# EAGLE design Track-Cam (EAGLE 9.2.2)
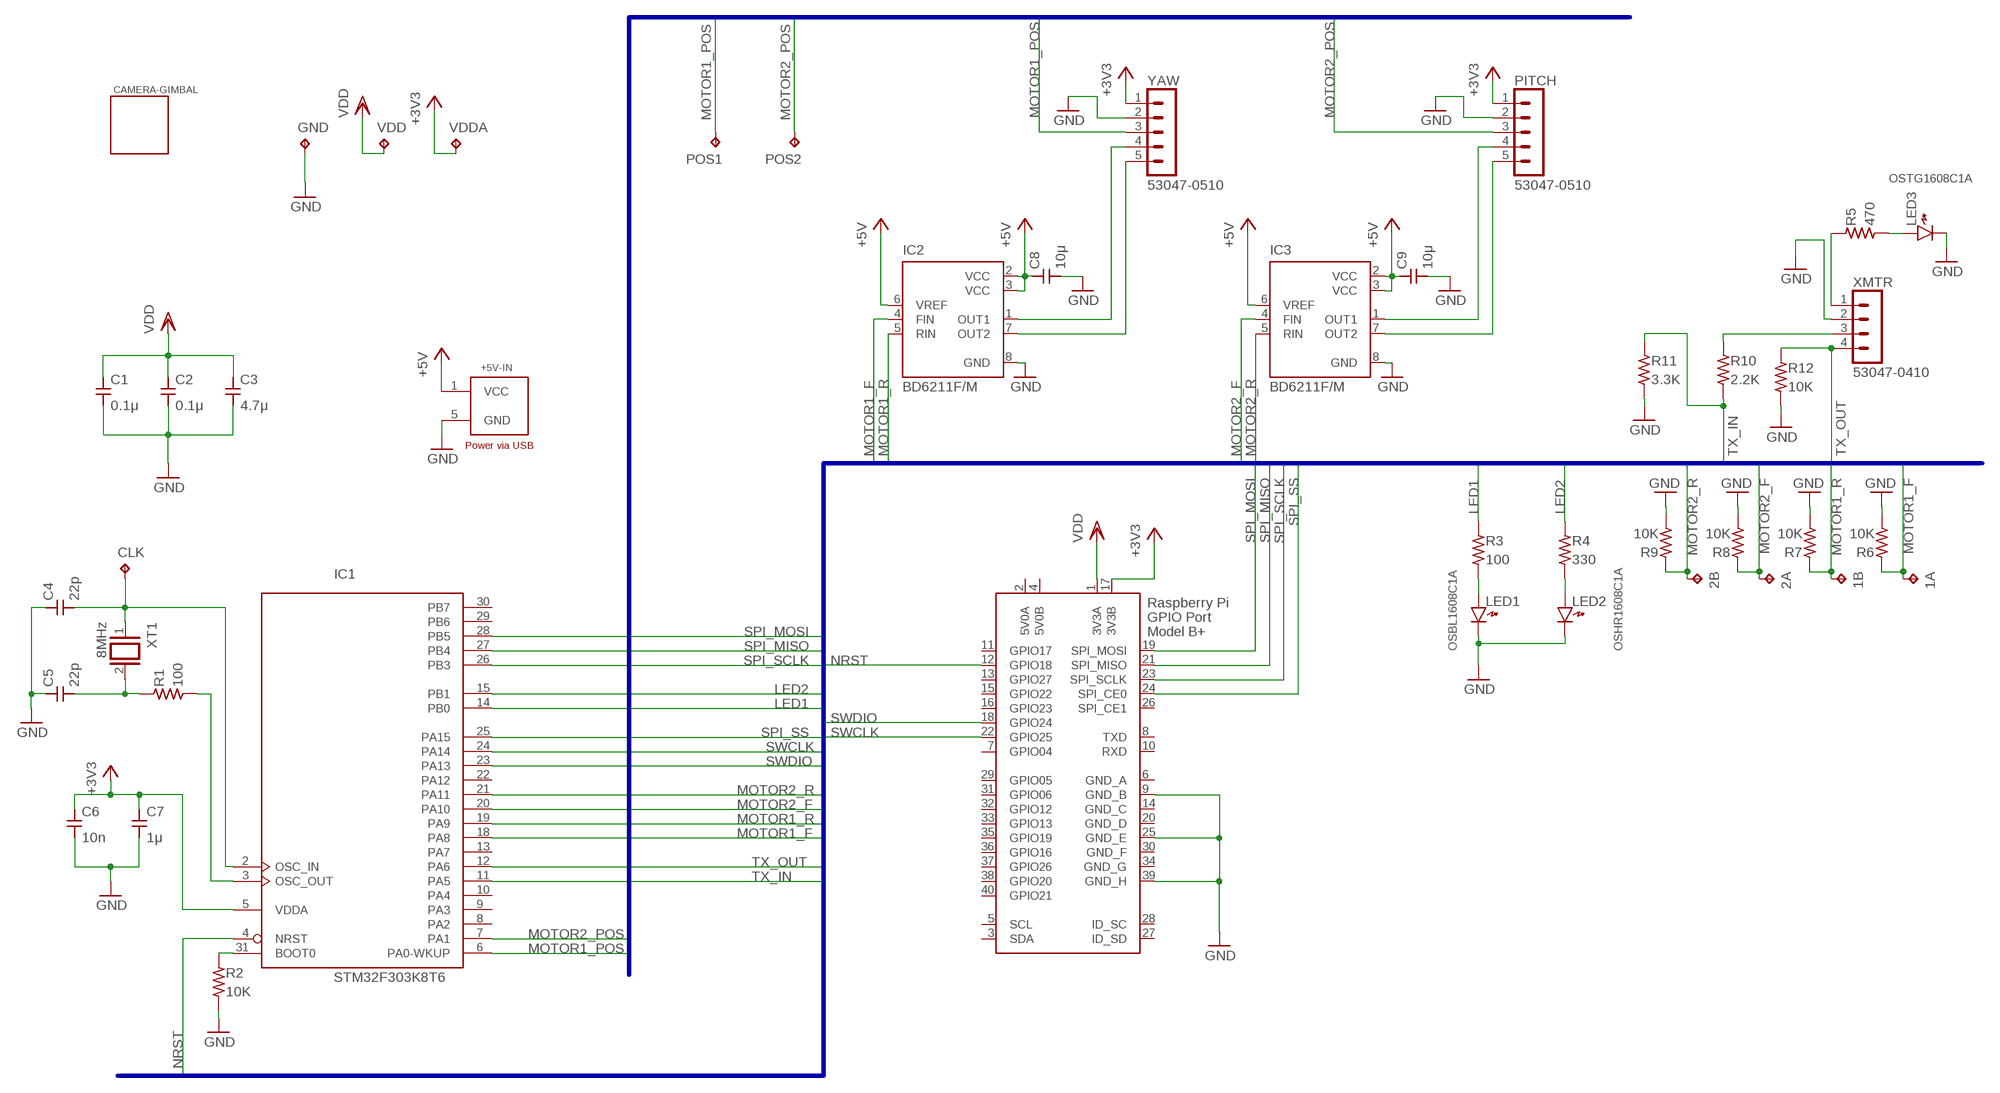
[diagram p0: schematic, sheet 1]

## Parts
1A  TPB1,27  [B1,27]
1B  TPB1,27  [B1,27]
2A  TPB1,27  [B1,27]
2B  TPB1,27  [B1,27]
+5V-IN  MRUSB-2B-D14NI-S306/M  [MICRO-USB-POWER/M]
C1  0.1μ  CAPACITOR2012  [SMD2012]
C2  0.1μ  CAPACITOR2012  [SMD2012]
C3  4.7μ  CAPACITOR2012  [SMD2012]
C4  22p  CAPACITOR1608  [SMD1608]
C5  22p  CAPACITOR1608  [SMD1608]
C6  10n  CAPACITOR2012  [SMD2012]
C7  1μ  CAPACITOR2012  [SMD2012]
C8  10μ  CAPACITOR2012  [SMD2012]
C9  10μ  CAPACITOR2012  [SMD2012]
CAMERA-GIMBAL  SG-90-CAMERA-MOUNT/NR  [SG90-CAMERA-MOUNT-NR]
CLK  TPB1,27  [B1,27]
GND  TPB1,27  [B1,27]
IC1  STM32F303K8T6  STM32F042KT/M  [LQFP32-M]
IC2  BD6211F/M  [SOP8/M]
IC3  BD6211F/M  [SOP8/M]
LED1  LED1608  [LED1608]
LED2  LED1608  [LED1608]
LED3  LED1608  [LED1608]
P1  RASPI_BOARD_B+#_HC  [RASPI_BOARD_B+HAT_CF]
PITCH  53047-0510  [53047-0510]
POS1  TPB1,27  [B1,27]
POS2  TPB1,27  [B1,27]
R1  100  RESISTOR-US2012  [SMD2012]
R2  10K  RESISTOR-US2012  [SMD2012]
R3  100  RESISTOR-US2012  [SMD2012]
R4  330  RESISTOR-US2012  [SMD2012]
R5  470  RESISTOR-US2012  [SMD2012]
R6  10K  RESISTOR-US2012  [SMD2012]
R7  10K  RESISTOR-US2012  [SMD2012]
R8  10K  RESISTOR-US2012  [SMD2012]
R9  10K  RESISTOR-US2012  [SMD2012]
R10  2.2K  RESISTOR-US2012  [SMD2012]
R11  3.3K  RESISTOR-US2012  [SMD2012]
R12  10K  RESISTOR-US2012  [SMD2012]
VDD  TPB1,27  [B1,27]
VDDA  TPB1,27  [B1,27]
XMTR  53047-0410  [53047-0410]
XT1  8MHz  XTAL/S  [QS]
YAW  53047-0510  [53047-0510]

## Nets
+3V3 [power]: C6.1 C7.1 IC1.5(VDDA) P1.17(3V3B) PITCH.1 VDDA.TP YAW.1
+5V [power]: +5V-IN.1(VCC) C8.1 C9.1 IC2.2(VCC) IC2.3(VCC) IC2.6(VREF) IC3.2(VCC) IC3.3(VCC) IC3.6(VREF)
BOOT0: IC1.31(BOOT0) R2.1
GND [gnd]: +5V-IN.5(GND) C1.2 C2.2 C3.2 C4.1 C5.1 C6.2 C7.2 C8.2 C9.2 GND.TP IC2.8(GND) IC3.8(GND) LED1.K LED2.K LED3.K P1.9(GND_B) P1.25(GND_E) P1.39(GND_H) PITCH.2 R2.2 R6.2 R7.2 R8.2 R9.2 R11.2 R12.2 XMTR.2 YAW.2
LED1: IC1.14(PB0) R3.1
LED2: IC1.15(PB1) R4.1
MOTOR1+: IC2.1(OUT1) YAW.4
MOTOR1-: IC2.7(OUT2) YAW.5
MOTOR1_F: 1A.TP IC1.18(PA8) IC2.4(FIN) R6.1
MOTOR1_POS: IC1.6(PA0-WKUP) POS1.TP YAW.3
MOTOR1_R: 1B.TP IC1.19(PA9) IC2.5(RIN) R7.1
MOTOR2+: IC3.1(OUT1) PITCH.4
MOTOR2-: IC3.7(OUT2) PITCH.5
MOTOR2_F: 2A.TP IC1.20(PA10) IC3.4(FIN) R8.1
MOTOR2_POS: IC1.7(PA1) PITCH.3 POS2.TP
MOTOR2_R: 2B.TP IC1.21(PA11) IC3.5(RIN) R9.1
N$1: C5.2 R1.1 XT1.2
N$8: LED1.A R3.2
N$9: LED2.A R4.2
N$10: R5.1 XMTR.1
N$11: LED3.A R5.2
NRST: IC1.4(NRST) P1.12(GPIO18)
OSC_IN: C4.2 CLK.TP IC1.2(OSC_IN) XT1.1
OSC_OUT: IC1.3(OSC_OUT) R1.2
SPI_MISO: IC1.27(PB4) P1.21(SPI_MISO)
SPI_MOSI: IC1.28(PB5) P1.19(SPI_MOSI)
SPI_SCLK: IC1.26(PB3) P1.23(SPI_SCLK)
SPI_SS: IC1.25(PA15) P1.24(SPI_CE0)
SWCLK: IC1.24(PA14) P1.22(GPIO25)
SWDIO: IC1.23(PA13) P1.18(GPIO24)
TX_IN: IC1.11(PA5) R10.2 R11.1
TX_IN_5V: R10.1 XMTR.3
TX_OUT: IC1.12(PA6) R12.1 XMTR.4
VDD [power]: C1.1 C2.1 C3.1 P1.1(3V3A) VDD.TP
Unconnected: IC1.8(PA2) IC1.9(PA3) IC1.10(PA4) IC1.13(PA7) IC1.22(PA12) IC1.29(PB6) IC1.30(PB7) P1.3(SDA) P1.5(SCL) P1.7(GPIO04) P1.8(TXD) P1.10(RXD) P1.11(GPIO17) P1.13(GPIO27) P1.15(GPIO22) P1.16(GPIO23) P1.26(SPI_CE1) P1.27(ID_SD) P1.28(ID_SC) P1.29(GPIO05) P1.31(GPIO06) P1.32(GPIO12) P1.33(GPIO13) P1.35(GPIO19) P1.36(GPIO16) P1.37(GPIO26) P1.38(GPIO20) P1.40(GPIO21)

## Buses
DIG[0..12]
ANA[0..1]

## Notes on the sheet
- OSTG1608C1A
- OSBL1608C1A | OSHR1608C1A

## Power pins joined to a net without a drawn wire
5V0A: P1.2(5V0A)
5V0B: P1.4(5V0B)
GND: IC1.16(GND) IC1.32(GND)
GND_A: P1.6(GND_A)
GND_C: P1.14(GND_C)
GND_D: P1.20(GND_D)
GND_F: P1.30(GND_F)
GND_G: P1.34(GND_G)
VDD: IC1.1(VDD) IC1.17(VDD)

## Library data of the parts
1A 1B 2A 2B CLK GND POS1 POS2 VDD VDDA = testpad:TP: Test pad
+5V-IN = connector:MRUSB-2B-D14NI-S306: Useconn Electronics Ltd. Micro USB, B type Female Solder type
C1-C9 = gen-discrete2:CAPACITOR: Generic Capacitor
CAMERA-GIMBAL = mech:SG-90-CAMERA-MOUNT
IC1 = stm32:STM32F042K*T: ARM 32-bit Cortex™-M0 CPU 48 MHz maximum frequency 32 Kbytes of Flash memory 6 kbytes of SRAM 26 GPIOs 2.4 to 3.6 V application supply
IC2 IC3 = rohm-modified:BD621*F: H-bridge driver for brush motors Source: http://www.rohm.com/products/databook/motor/pdf/bd623x_series-e.pdf
LED1-LED3 = gen-discrete:LED: Generic LEDs
P1 = raspi:RASPI_BOARD_B+#: Raspberry Pi GPIO connector with markings for the outer dimensions of the Raspberry Pi board model B+ with different sets of drill holes or mounting pads All pins connected
PITCH YAW = connector:53047-0510: HEADER
R1-R12 = gen-discrete:RESISTOR-US: Generic Registor
XMTR = connector:53047-0410: HEADER
XT1 = gen-discrete:XTAL/S: CRYSTAL

## Net classes
1 gnd: width 0.61 mm, drill 0.203 mm
2 power: width 0.61 mm, drill 0.203 mm

## Board
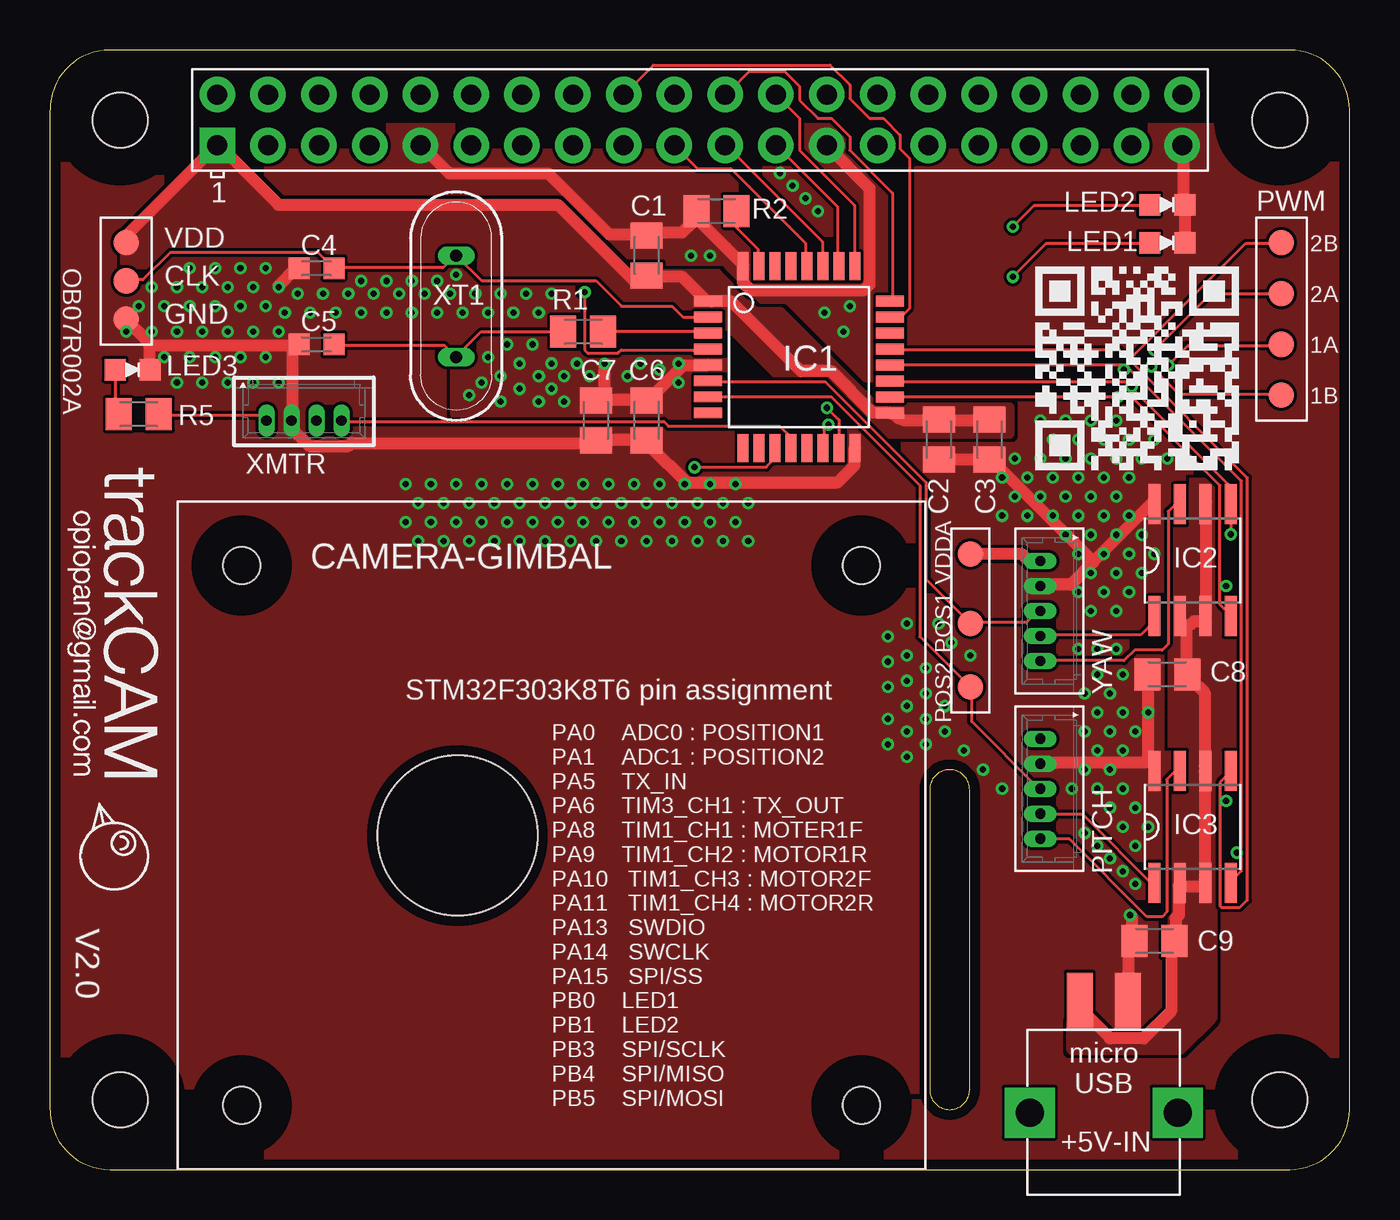
[diagram p1: board, top side]
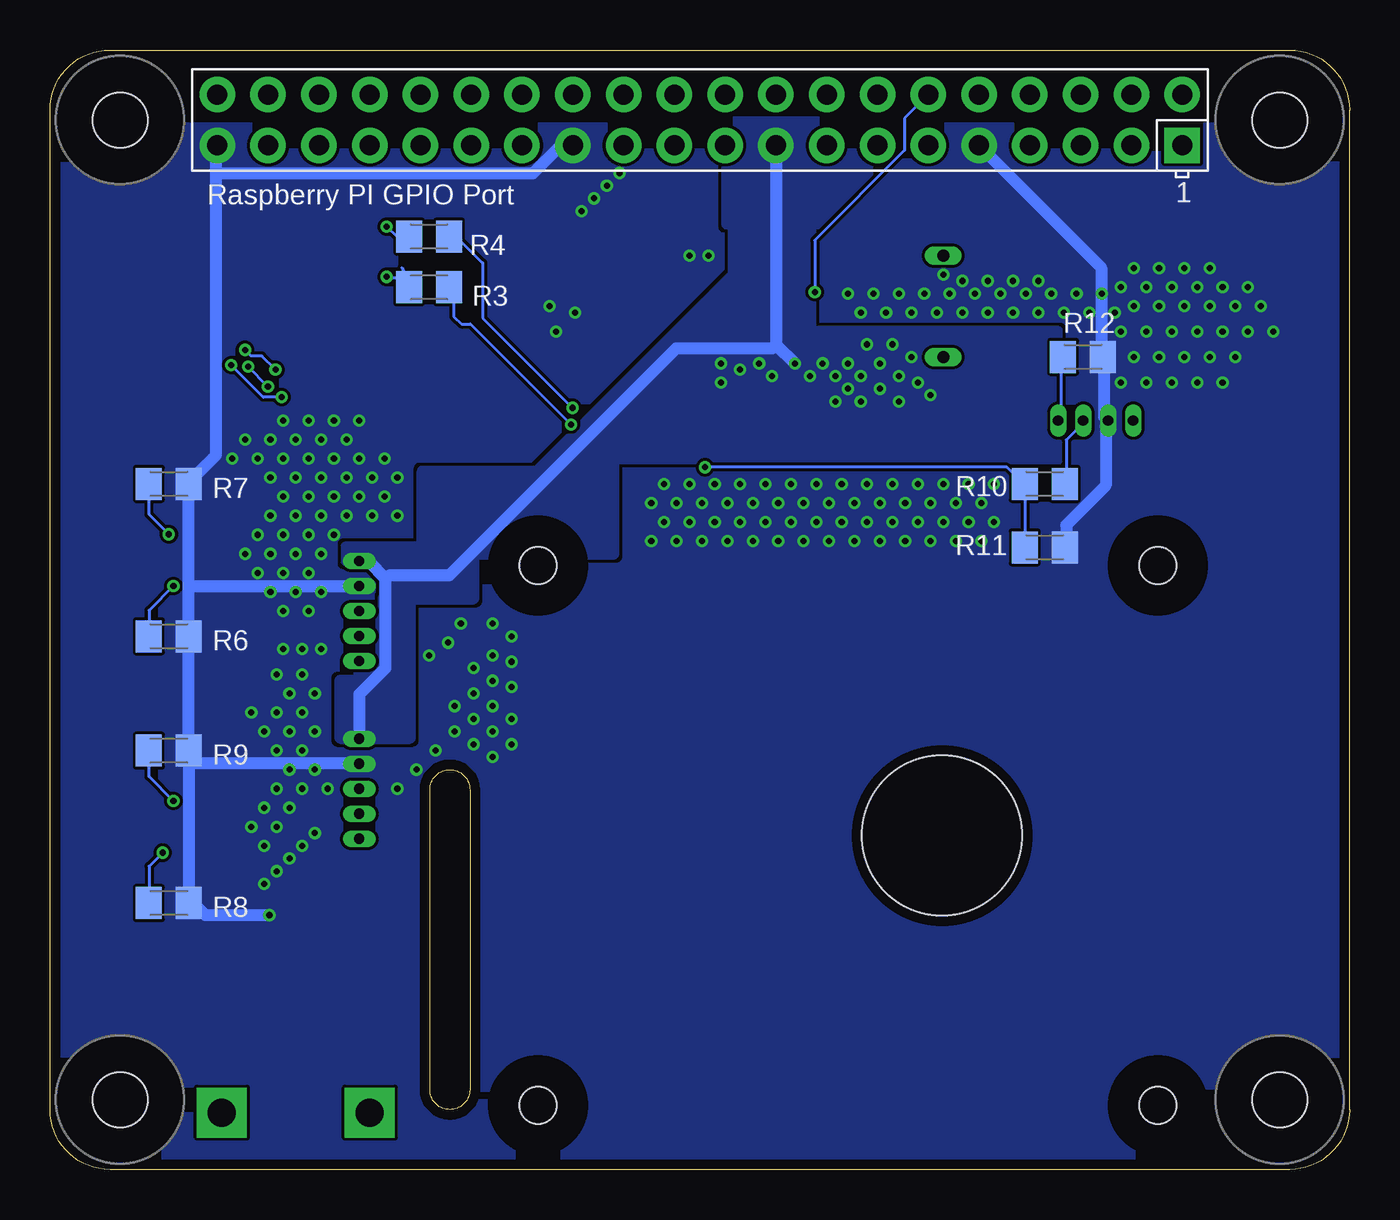
[diagram p2: board, bottom side, seen from below]

Size 65 x 56 mm. Coordinates in mm from the lower left corner, seen from the top.
Copper layers (1*16): Top 0.035mm / dielectric 1.6mm / Bottom 0.035mm
Design rules "Elecrow_2-layer_PCB_eagle_rule": minimum track width 6mil, minimum drill 12mil, track to track 6mil, track to pad 6mil, pad to pad 6mil, via to via 8mil, smd to smd 0mil, copper to edge 20mil, drill to drill 10mil, minimum pad ring 6mil, minimum via ring 6mil, stop-mask expansion 0mil, vias tented up to drill 100mil, thermal gap 10mil

### Footprints (pad centres in the part's own frame; a part is rotated, then mirrored left to right if it is on the bottom)
B1,27 = smd 1.27 x 1.27: TP 0,0
MICRO-USB-POWER/M = smd 1.3 x 2.8: 1 1.2,-2.1; 5 -1.2,-2.1 | drill 1.4 pad 2.5 square: FIX1 -3.7,3.5; FIX2 3.7,3.5
SMD2012 = smd 1.3 x 1.6: 1 -1,0; 2 1,0
SMD1608 = smd 1.05 x 1.08: 1 -0.875,0; 2 0.875,0
SG90-CAMERA-MOUNT-NR = hole 1.85: -15.5,13.5; 15.5,13.5; 15.5,-13.5; -15.5,-13.5 | hole 8: -4.7,0
LQFP32-M = smd 0.54 x 1.4: 1 -2.8,-4.55; 2 -2,-4.55; 3 -1.2,-4.55; 4 -0.4,-4.55; 5 0.4,-4.55; 6 1.19,-4.55; 7 1.99,-4.55; 8 2.79,-4.55; 17 2.8,4.55; 18 2,4.55; 19 1.2,4.55; 20 0.4,4.55; 21 -0.4,4.55; 22 -1.2,4.55; 23 -2,4.55; 24 -2.8,4.55 | smd 1.4 x 0.54: 9 4.55,-2.8; 10 4.55,-2; 11 4.55,-1.2; 12 4.55,-0.4; 13 4.55,0.4; 14 4.55,1.2; 15 4.55,2; 16 4.55,2.8; 25 -4.55,2.8; 26 -4.55,2; 27 -4.55,1.2; 28 -4.55,0.4; 29 -4.55,-0.4; 30 -4.55,-1.2; 31 -4.55,-2; 32 -4.55,-2.8
SOP8/M = smd 0.6 x 2: 1 -1.905,-2.8; 2 -0.635,-2.8; 3 0.635,-2.8; 4 1.905,-2.8; 5 1.905,2.8; 6 0.635,2.8; 7 -0.635,2.8; 8 -1.905,2.8
LED1608 = smd 1.05 x 1.08: A -0.875,0; K 0.875,0
RASPI_BOARD_B+HAT_CF = drill 1 pad 1.778 square: 1 8.37,51.23 | drill 1 pad 1.778: 2 8.37,53.77; 3 10.91,51.23; 4 10.91,53.77; 5 13.45,51.23; 6 13.45,53.77; 7 15.99,51.23; 8 15.99,53.77; 9 18.53,51.23; 10 18.53,53.77; 11 21.07,51.23; 12 21.07,53.77; 13 23.61,51.23; 14 23.61,53.77; 15 26.15,51.23; 16 26.15,53.77; 17 28.69,51.23; 18 28.69,53.77; 19 31.23,51.23; 20 31.23,53.77; 21 33.77,51.23; 22 33.77,53.77; 23 36.31,51.23; 24 36.31,53.77; 25 38.85,51.23; 26 38.85,53.77; 27 41.39,51.23; 28 41.39,53.77; 29 43.93,51.23; 30 43.93,53.77; 31 46.47,51.23; 32 46.47,53.77; 33 49.01,51.23; 34 49.01,53.77; 35 51.55,51.23; 36 51.55,53.77; 37 54.09,51.23; 38 54.09,53.77; 39 56.63,51.23; 40 56.63,53.77 | hole 2.75: 3.5,3.5; 3.5,52.5; 61.5,3.5; 61.5,52.5
53047-0510 = drill 0.508 long: 1 2.5,0; 2 1.25,0; 3 0,0; 4 -1.25,0; 5 -2.5,0
53047-0410 = drill 0.508 long: 1 1.875,0; 2 0.625,0; 3 -0.625,0; 4 -1.875,0
QS = drill 0.61 long: 1 -2.54,0; 2 2.54,0

### Placement (x,y rotation side)
1A  61.59,41.27 0 top
1B  61.59,38.73 0 top
2A  61.59,43.81 0 top
2B  61.59,46.35 0 top
+5V-IN  52.7,6.35 180 top
C1  29.84,45.72 90 top
C2  44.45,36.51 270 top
C3  46.99,36.51 270 top
C4  13.34,45.09 0 top
C5  13.34,41.27 0 top
C6  29.84,37.47 270 top
C7  27.3,37.47 270 top
C8  55.88,24.77 180 top
C9  55.24,11.43 180 top
CAMERA-GIMBAL  25.08,16.7 0 top
CLK  3.81,44.45 0 top
GND  3.81,42.55 0 top
IC1  37.47,40.64 270 top
IC2  57.15,30.48 0 top
IC3  57.15,17.14 0 top
LED1  55.88,46.35 0 top
LED2  55.88,48.26 0 top
LED3  4.13,40.01 0 top
P1  0,0 0 top
PITCH  49.53,19.05 90 top
POS1  46.04,27.3 0 top
POS2  46.04,24.13 0 top
R1  26.67,41.91 0 top
R2  33.34,47.94 180 top
R3  46.04,44.13 180 bottom
R4  46.04,46.67 180 bottom
R5  4.45,37.78 180 top
R6  59.05,26.67 0 bottom
R7  59.05,34.29 0 bottom
R8  59.05,13.34 0 bottom
R9  59.05,20.95 0 bottom
R10  15.24,34.29 180 bottom
R11  15.24,31.11 0 bottom
R12  13.34,40.64 0 bottom
U$1  [OPIOPAN-LOGO]  0.95,18.41 270 top
U$2  [TRACKCAM-LOGO]  0.64,35.88 270 top
U$3  [TRACKCAM-QRCODE]  47.94,33.66 0 top
VDD  3.81,46.35 0 top
VDDA  46.04,30.8 0 top
XMTR  12.7,37.47 180 top
XT1  20.32,43.18 270 top
YAW  49.53,27.94 90 top

### Tracks (layer width: path | path; a pad name or v marks a point on that pad's centre or on a via)
+3V3  (via drill 0.3)
  Top 0.61: IC1.5 32.77,40.23 31.7,40.23 30.1,38.63 C6.1 29.79,38.48 27.36,38.48 C7.1 27.74,38.71 v27.74,40.31 | 49.07,30.4 49.53,30.4 YAW.1 48.84,30.56 48.62,30.79 46.1,30.79 VDDA.TP
  Bottom 0.61: 28.65,41.22 28.65,51.21 P1.17 | v27.74,40.31 28.65,41.22 | PITCH.1 49.53,23.77 48.23,25.07 48.23,29.57 | 48.23,29.57 49.07,30.4 49.53,30.4 YAW.1 | 48.23,29.57 48.01,29.72 45.03,29.72 33.68,41.07 28.88,41.07 28.65,41.22
  other vias: 20.95,38.73 21.59,39.37 22.54,38.42 22.54,39.69 21.91,40.64 22.86,41.27 23.5,40.32 23.5,39.05 24.45,38.42 25.72,38.42 25.08,39.05 24.45,39.69 25.08,40.32 24.13,41.27 26.35,40.32 25.72,39.69 26.99,39.69 28.89,39.69 29.53,40.32 30.48,40.01 31.43,39.37 31.43,40.32
  pour Bottom (no thermals): 30.8,51.12 26.99,51.12 26.99,41.91 14.61,41.91 14.61,35.56 36.83,35.56 36.83,30.8 46.35,30.8 46.35,34.92 40.64,34.92 30.8,44.77
  pour Top (no thermals): 20.32,40.32 21.59,41.59 33.66,41.59 33.66,37.78 20.32,37.78
  pour Bottom (no thermals): 50.48,24.45 50.48,21.59 46.99,21.59 46.99,24.45
  pour Bottom (no thermals): 31.11,47.31 31.11,52.39 22.86,52.39 22.86,51.12 26.67,47.31
  pour Bottom (no thermals): 45.72,31.75 46.35,31.11 50.16,31.11 50.16,30.48 48.9,30.48 48.26,29.84 48.26,28.57 49.53,27.3 49.53,23.5 46.99,23.5 46.99,28.57 43.81,28.57 43.81,31.75
+5V
  Top 0.61: 56.84,27.13 56.84,24.77 C8.1 57.07,24.54 57.76,23.85 57.76,20.19 IC3.6 57.76,19.89 57.76,14.48 IC3.3 57.76,14.17 56.77,14.17 IC3.2 56.46,14.1 56.46,12.72 56.31,12.57 56.31,11.43 C9.1 56.08,11.2 56.08,7.92 54.71,6.55 53.03,6.55 51.51,8.08 51.51,8.38 +5V-IN.1 | 56.84,27.13 56.54,27.43 IC2.2 | 56.84,27.13 57.07,27.28 57.23,27.43 57.76,27.43 IC2.3 57.84,27.74 57.84,33.45 IC2.6
  pour Top (no thermals): 52.07,7.3 51.12,7.3 51.12,6.03 56.52,6.03 58.1,7.62 58.1,34.29 56.2,34.29 56.2,7.62 54.93,6.35 52.7,6.35 52.07,6.99
  pour Top (no thermals): 57.78,28.26 59.37,28.26 59.37,19.37 57.78,19.37
BOOT0
  Top 0.152: R2.1 34.37,47.93 34.37,47.09 35.43,46.02 35.43,45.34 IC1.31
GND  (via drill 0.3)
  Top 0.61: P1.25 38.86,51.21 41,49.07 41,44.27 40.69,43.97 35.05,43.97 34.67,44.35 34.67,45.03 IC1.32 34.59,45.34 32.38,47.55 32.38,47.93 R2.2 32.16,47.4 31.62,46.86 30.1,46.86 C1.2 29.79,46.79 27.96,46.79 24.92,49.84 19.96,49.84 18.59,51.21 P1.9 | 54.94,20.5 54.94,24.77 C8.2 | 54.94,20.5 55.24,20.19 IC3.8 | PITCH.2 49.53,20.34 54.71,20.34 54.94,20.5 | 52.2,30.4 55.24,33.45 IC2.8 | 52.2,30.4 51.05,29.26 49.53,29.26 YAW.2 | 54.25,11.43 C9.2 | v54.03,12.72 54.1,12.65 54.1,11.66 C9.2 | IC1.16 40.23,36.04 40.23,35.2 39.4,34.37 31.85,34.37 30.02,36.2 C6.2 29.79,36.5 27.36,36.5 C7.2 27.05,36.35 15.09,36.35 14.94,36.2 12.95,36.2 12.19,36.96 12.19,37.19 XMTR.2 12.12,37.72 12.12,40.92 C5.1 12.12,41.22 4.95,41.22 | LED1.K 56.77,46.41 56.77,48.23 LED2.K 56.69,48.54 56.69,51.21 P1.39 | 4.95,41.22 4.95,41.38 3.81,42.52 GND.TP | 4.95,41.22 4.95,40.01 LED3.K | C2.2 44.5,35.51 46.94,35.51 C3.2 47.24,35.36 52.2,30.4 | +5V-IN.5 53.95,8.46 53.95,11.05 54.1,11.2 C9.2 | C4.1 12.42,45.03 12.27,45.03 11.43,44.2 v11.43,44.13
  Bottom 0.61: R9.2 58.06,20.95 58.06,13.34 R8.2 57.76,13.26 57.23,12.72 v54.03,12.72 | R9.2 58.06,21.18 58.06,26.67 R6.2 58.06,26.9 58.06,29.18 | 58.06,29.18 58.06,34.29 R7.2 57.91,34.52 56.69,35.74 56.69,49.84 | 58.06,29.18 YAW.2 | PITCH.2 49.53,20.34 57.84,20.34 R9.2 | 56.69,49.84 56.69,51.21 P1.39 | 56.69,49.84 40.84,49.84 39.47,51.21 39.17,51.21 P1.25 | R11.2 14.17,31.17 14.17,32.23 12.19,34.21 12.19,37.19 XMTR.2 12.27,37.64 12.27,40.62 R12.2 12.42,40.92 12.42,45.11 18.52,51.21 P1.9
  other vias: 49.53,37.47 50.8,37.47 52.07,37.47 53.34,37.47 48.26,35.56 48.9,34.61 50.16,36.51 51.44,36.51 52.7,36.51 53.98,36.51 55.24,36.51 55.88,35.56 54.61,35.56 53.34,35.56 52.07,35.56 50.8,35.56 49.53,35.56 50.16,34.61 51.44,34.61 52.7,34.61 53.98,34.61 49.53,33.66 50.8,33.66 52.07,33.66 53.34,33.66 50.16,32.7 51.44,32.7 52.7,32.7 53.98,32.7 53.34,31.75 54.61,31.75 52.07,31.75 50.8,31.75 55.24,30.8 53.98,30.8 52.7,30.8 51.44,30.8 52.07,29.84 53.34,29.84 54.61,29.84 53.98,28.89 52.7,28.89 51.44,28.89 53.34,27.94 52.07,27.94 53.66,24.77 52.39,24.77 53.02,23.81 51.75,23.81 52.39,22.86 54.93,22.86 54.29,21.91 53.02,21.91 51.75,21.91 53.66,20.95 52.39,20.95 53.02,20 51.75,20 52.39,19.05 53.66,19.05 51.12,19.05 53.02,18.1 54.29,18.1 53.66,17.14 54.93,17.14 54.29,16.19 31.75,34.29 30.48,34.29 29.21,34.29 27.94,34.29 26.67,34.29 25.4,34.29 24.13,34.29 22.86,34.29 21.59,34.29 20.32,34.29 19.05,34.29 17.78,34.29 18.41,33.34 19.68,33.34 20.95,33.34 22.23,33.34 23.5,33.34 24.77,33.34 26.04,33.34 27.3,33.34 28.57,33.34 29.84,33.34 31.11,33.34 31.75,32.38 30.48,32.38 29.21,32.38 27.94,32.38 26.67,32.38 25.4,32.38 24.13,32.38 22.86,32.38 21.59,32.38 20.32,32.38 19.05,32.38 17.78,32.38 31.11,31.43 29.84,31.43 28.57,31.43 27.3,31.43 26.04,31.43 24.77,31.43 23.5,31.43 22.23,31.43 20.95,31.43 19.68,31.43 18.41,31.43 10.16,44.13 8.89,44.13 7.62,44.13 6.35,44.13 5.08,44.13 10.79,43.18 9.53,43.18 8.26,43.18 6.99,43.18 5.71,43.18 4.45,43.18 11.43,41.91 10.16,41.91 8.89,41.91 7.62,41.91 6.35,41.91 5.08,41.91 10.79,40.64 9.53,40.64 8.26,40.64 6.99,40.64 5.71,40.64 6.35,39.37 7.62,39.37 8.89,39.37 10.16,39.37 11.43,39.37 36.51,49.85 37.15,49.21 37.78,48.58 38.42,47.94 15.56,42.86 16.19,43.81 16.83,42.86 18.1,42.86 17.46,43.81 19.37,42.86 18.73,43.81 20,43.81 14.92,43.81 20.64,42.86 21.27,43.81 21.91,42.86 22.54,43.81 20.32,44.77 53.34,26.04 52.39,26.04 51.44,26.04 53.66,22.86 54.29,14.29 53.66,14.92 53.02,15.56 52.39,16.19 51.75,16.83 23.81,43.81 23.18,42.86 24.45,42.86 25.08,43.81 15.56,44.45 16.83,44.45 18.1,44.45 19.37,44.45 14.29,42.86 13.02,42.86 11.75,42.86 13.65,43.81 12.38,43.81 6.99,45.09 8.26,45.09 9.53,45.09 10.79,45.09 3.81,41.91 32.07,45.72 33.02,45.72 38.73,42.86 39.69,41.91 40.01,43.18 47.62,34.61 48.26,33.66 48.9,32.7 47.62,32.7 46.04,25.72 45.09,26.35 44.45,27.3 47.62,19.05 46.67,20 45.72,20.95 44.77,21.91 44.77,23.18 43.81,25.08 43.81,22.54 43.81,23.81 42.86,24.45 42.86,23.18 42.86,25.72 42.86,27.3 43.81,21.27 41.91,24.13 41.91,25.4 41.91,26.67 42.86,21.91 41.91,22.54 41.91,21.27 42.86,20.64 32.38,33.34 33.02,34.29 33.66,33.34 33.02,32.38 32.38,31.43 33.66,31.43 34.29,32.38 34.29,34.29 34.92,33.34 34.92,31.43
  pour Bottom (rank 6, no thermals): 0,52.07 66.04,52.07 66.04,-0.64 0,-0.64
  pour Top (rank 6, no thermals): 65.41,-0.64 -0.64,-0.64 -0.64,52.07 65.41,52.07
LED1  (via drill 0.3)
  Top 0.152: v38.94,37.26 38.71,37.03 38.71,36.12 IC1.14
  Bottom 0.152: v38.94,37.26 43.97,42.29 44.42,42.29 44.81,42.67 44.81,43.89 R3.1
LED2  (via drill 0.3)
  Top 0.152: v38.86,38.1 39.47,37.49 39.47,36.12 IC1.15
  Bottom 0.152: v38.86,38.1 43.36,42.6 43.36,45.34 44.65,46.63 45.03,46.63 R4.1
MOTOR1+
  Top 0.152: YAW.4 49.53,26.75 54.56,26.75 55.24,27.43 IC2.1
MOTOR1-
  Top 0.152: YAW.5 49.53,25.45 53.72,25.45 54.25,25.98 55.63,25.98 55.93,26.29 55.93,32.92 56.46,33.45 IC2.7
MOTOR1_F  (via drill 0.3)
  Top 0.152: 58.52,29.18 58.52,28.27 59.05,27.74 IC2.4 | 58.52,29.18 58.52,34.21 54.1,38.63 v53.42,38.63 42.06,38.63 IC1.18 | v55.93,40.23 56.92,41.22 61.57,41.22 1A.TP | 58.52,29.18 v58.83,29.18
  Bottom 0.152: v55.93,40.23 54.33,38.63 v53.42,38.63 | v58.83,29.18 60.05,27.96 R6.1
MOTOR1_POS
  Top 0.152: 49.38,27.89 49.53,27.89 YAW.3 49.38,27.89 | IC1.6 32.92,39.4 38.79,39.4 43.81,34.37 43.81,29.53 POS1.TP | 49.38,27.89 48.84,27.36 46.1,27.36 POS1.TP | 46.1,27.43 POS1.TP
MOTOR1_R  (via drill 0.3)
  Top 0.152: 54.06,39.13 59.05,34.14 IC2.5 v59.05,31.77 | 54.06,39.13 53.8,39.4 42.06,39.4 IC1.19 | v55.09,40.16 56.46,38.79 61.57,38.79 1B.TP | v54.1,39.17 54.06,39.13
  Bottom 0.152: v54.1,39.17 v55.09,40.16 | v59.05,31.77 60.05,32.77 R7.1
MOTOR2+
  Top 0.152: PITCH.4 49.53,17.75 51.66,17.75 55.24,14.17 IC3.1
MOTOR2-
  Top 0.152: PITCH.5 49.53,16.54 50.98,16.54 54.86,12.65 55.63,12.65 55.85,12.88 55.85,19.51 56.46,20.12 IC3.7
MOTOR2_F  (via drill 0.3)
  Top 0.152: 53.87,40.16 59.59,34.44 59.59,15.85 | 53.87,40.16 53.8,40.23 42.06,40.23 IC1.20 | 59.59,15.85 59.59,14.94 59.05,14.4 IC3.4 | 2A.TP 58.06,43.81 v55.24,41 | 53.87,40.16 v53.72,40.01 | 59.59,15.85 v59.36,15.85
  Bottom 0.152: v55.24,41 54.94,40.69 54.41,40.69 v53.72,40.01 | v59.36,15.85 60.05,15.16 R8.1
MOTOR2_POS
  Top 0.152: IC1.7 32.92,38.63 39.09,38.63 43.51,34.21 43.51,26.66 POS2.TP | POS2.TP 46.1,24.08 46.1,22.4 49.45,19.05 PITCH.3 | 46.02,24.16 POS2.TP
MOTOR2_R  (via drill 0.3)
  Top 0.152: 53.99,40.5 59.89,34.59 59.89,13.49 59.51,13.11 58.6,13.11 58.52,13.18 58.52,18.44 | 53.99,40.5 53.49,41 42.06,41 IC1.21 | 58.52,18.44 58.52,19.36 59.05,19.89 IC3.5 | 53.99,40.5 59.82,46.33 61.57,46.33 2B.TP | 58.52,18.44 v58.83,18.44
  Bottom 0.152: v58.83,18.44 60.05,19.66 R9.1
N$1
  Top 0.152: C5.2 14.25,41.22 19.74,41.22 XT1.2 20.34,40.69 21.57,41.91 R1.1
N$8  (via drill 0.3)
  Top 0.152: v48.16,44.65 49.84,46.33 54.94,46.33 LED1.A
  Bottom 0.152: 47.4,45.11 R3.2 47.24,44.58 48.08,44.58 v48.16,44.65
N$9  (via drill 0.3)
  Top 0.152: v48.16,47.17 49.23,48.23 54.94,48.23 LED2.A
  Bottom 0.152: v48.16,47.17 47.62,46.63 47.09,46.63 R4.2
N$10
  Top 0.152: R5.1 5.49,37.72 10.59,37.72 10.82,37.49 XMTR.1
N$11
  Top 0.152: LED3.A 3.28,40.01 3.28,37.95 3.43,37.8 R5.2
NRST  (via drill 0.3)
  Top 0.152: v26.75,43.89 26.75,41 26.9,40.84 28.42,40.84 28.57,41 32.84,41 IC1.4
  Bottom 0.152: v26.75,43.89 26.75,46.48 22.25,50.98 22.25,52.58 21.11,53.72 P1.12
OSC_IN
  Top 0.152: IC1.2 31.66,42.64 31.11,43.18 28.57,43.18 27.3,44.45 21.59,44.45 XT1.1 20.27,45.72 19.66,45.11 14.25,45.11 C4.2 14.17,45.11 13.41,45.87 6.02,45.87 4.65,44.5 3.81,44.5 CLK.TP
OSC_OUT
  Top 0.152: R1.2 32.77,41.91 IC1.3
SPI_MISO
  Top 0.152: IC1.27 38.63,45.34 38.63,46.41 33.83,51.21 P1.21
SPI_MOSI
  Top 0.152: IC1.28 37.8,45.34 37.8,46.33 34.06,50.06 32.38,50.06 31.24,51.21 P1.19
SPI_SCLK
  Top 0.152: IC1.26 39.4,45.34 39.4,48.16 36.35,51.21 P1.23
SPI_SS
  Top 0.152: IC1.25 40.23,45.34 40.23,48.23 37.49,50.98 37.49,52.58 36.35,53.72 P1.24
SWCLK
  Top 0.152: IC1.24 42.14,43.51 42.14,48.84 40.01,50.98 40.01,51.66 39.09,52.58 38.41,52.58 37.49,53.49 37.49,54.18 36.73,54.94 34.98,54.94 33.83,53.8 P1.22
SWDIO
  Top 0.152: IC1.23 42.06,42.67 42.6,42.67 42.98,43.05 42.98,50.6 42.52,51.05 42.52,51.74 41.68,52.58 41,52.58 40.01,53.57 40.01,54.25 39.01,55.24 30.18,55.24 28.73,53.8 P1.18
TX_IN  (via drill 0.3)
  Top 0.152: v32.23,35.13 35.81,35.13 36.2,35.51 36.2,36.04 IC1.11
  Bottom 0.152: v32.23,35.13 17.14,35.13 16.31,34.29 R10.2 16.23,31.17 R11.1
TX_IN_5V
  Bottom 0.152: R10.1 14.17,34.29 14.17,36.5 13.26,37.41 XMTR.3
TX_OUT
  Top 0.152: IC1.12 37.03,36.12 37.03,36.65 36.5,37.19 30.94,37.19 30.71,37.41 14.63,37.41 XMTR.4
  Bottom 0.152: 14.4,37.64 14.55,37.49 XMTR.4 14.4,37.64 | 14.4,40.01 R12.1 14.4,39.93 14.4,37.64
VDD
  Top 0.61: VDD.TP 3.81,46.71 8.31,51.21 P1.1 8.46,51.23 11.43,48.26 25.4,48.26 29.21,44.45 29.49,44.58 29.57,44.65 C1.1 29.87,44.65 31.62,44.65 32.77,43.51 IC1.1 33.07,43.43 34.06,43.43 37.57,39.93 39.09,39.93 41.15,37.87 41.83,37.87 IC1.17 42.29,37.72 42.44,37.57 42.67,37.49 44.42,37.49 C2.1 44.73,37.49 46.94,37.49 C3.1
  pour Top (rank 2, no thermals): 8.57,51.12 11.43,48.26 25.4,48.26 28.89,44.77 33.34,44.77 35.24,42.86 36.51,42.86 41.27,38.1 47.94,38.1 47.94,36.83 41.27,36.83 38.42,39.69 36.51,39.69 33.66,42.55 29.21,42.55 26.99,44.77 21.91,44.77 20.64,46.04 20,46.04 19.37,45.4 13.97,45.4 13.34,46.04 5.71,46.04 4.45,44.77 3.81,44.77 3.81,46.67 8.26,51.12

### Text on the board
tPlace: PWM | OB07R002A | STM32F303K8T6 pin assignment | V2.0 | PA0 ADC0 : POSITION1 / PA1 ADC1 : POSITION2 / PA5 TX_IN / PA6 TIM3_CH1 : TX_OUT / PA8 TIM1_CH1 : MOTER1F / PA9 TIM1_CH2 : MOTOR1R / PA10 TIM1_CH3 : MOTOR2F / PA11 TIM1_CH4 : MOTOR2R / PA13 SWDIO / PA14 SWCLK / PA15 SPI/SS / PB0 LED1 / PB1 LED2 / PB3 SPI/SCLK / PB4 SPI/MISO / PB5 SPI/MOSI